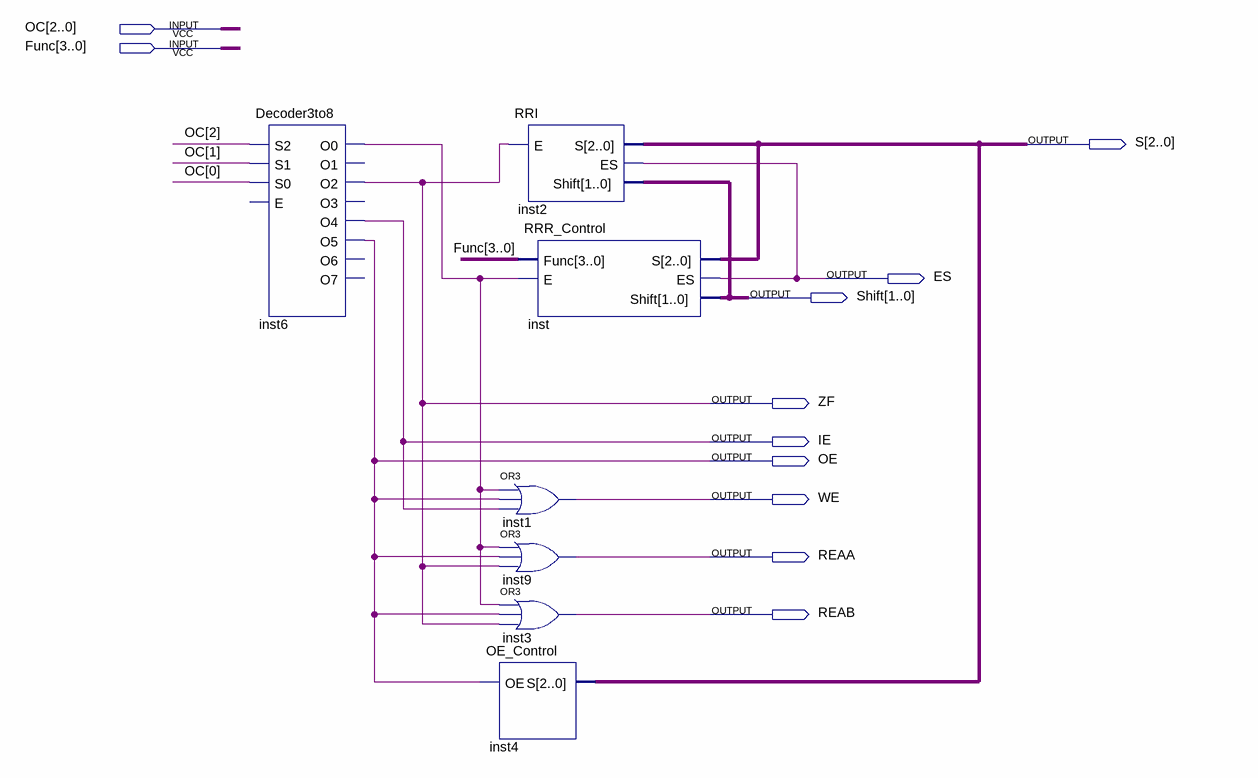
[diagram p0: schematic sheet]
// Quartus schematic Instruction_Controller.bdf as structural Verilog: 7 symbols, 11 pins
module Instruction_Controller (
  input  [2:0] OC,
  input  [3:0] Func,
  output [2:0] S,
  output ES,
  output [1:0] Shift,
  output ZF,
  output IE,
  output OE,
  output WE,
  output REAA,
  output REAB
);

  wire inst6_o0;

  Decoder3to8 inst6 (
    .S2(OC[2]), .S1(OC[1]), .S0(OC[0]), .O0(inst6_o0), .O2(ZF), .O4(IE), .O5(OE));  // open: E, O1, O3, O6, O7
  or inst1 (WE, inst6_o0, OE, IE);
  or inst9 (REAA, inst6_o0, OE, ZF);
  or inst3 (REAB, inst6_o0, OE, ZF);
  OE_Control inst4 (.OE(OE), .S(S));
  RRI inst2 (.E(ZF), .S(S), .ES(ES), .Shift(Shift));
  RRR_Control inst (.Func(Func), .E(inst6_o0), .S(S), .ES(ES), .Shift(Shift));
endmodule
